# Altium schematic sheet fuenteProgramable.SchDoc
size A4
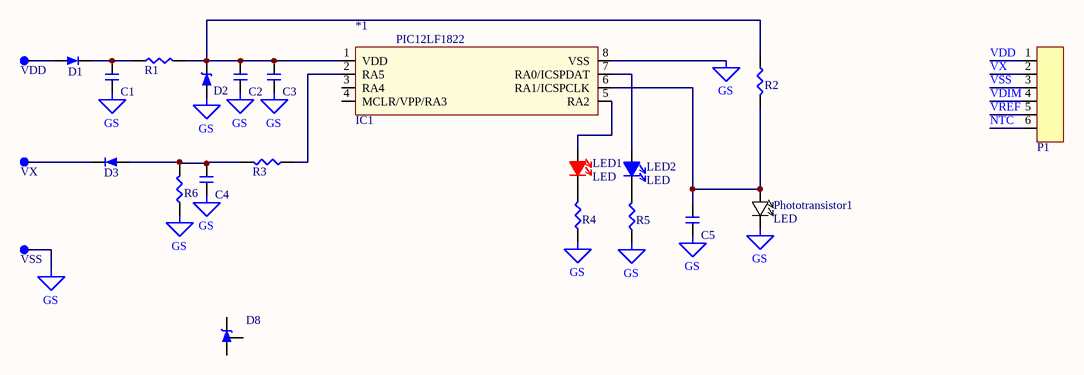
[diagram p0: fuenteProgramable.SchDoc]

## Parts
*1  IC1  [SOIC-8]
C1  Capacitor  [0805]  (value not drawn)
C2  Capacitor  [0805]  (value not drawn)
C3  Capacitor  [0805]  (value not drawn)
C4  Capacitor  [0805]  (value not drawn)
C5  Capacitor  [0805]  (value not drawn)
D1  Diodo  [0805]  (value not drawn)
D2  Zener  [MINIMELF]  (value not drawn)
D3  Diodo  [0805]  (value not drawn)
D8  TL431  [SOT23]  (value not drawn)
LED1  LED  [LED Red 3mm TH V]
LED2  LED  [LED Blue 3mm TH V]
P1  C6pin  [C6PB]  (value not drawn)
Phototransistor1  LED  [LED White 3mm TH V]
R1  Resistencia  [0805]  (value not drawn)
R2  Resistencia  [0805]  (value not drawn)
R3  Resistencia  [0805]  (value not drawn)
R4  Resistencia  [0805]  (value not drawn)
R5  Resistencia  [0805]  (value not drawn)
R6  Resistencia  [0805]  (value not drawn)
VDD  Pad  [Pad3x5]  (value not drawn)  (no BOM)
VSS  Pad  [Pad3x5]  (value not drawn)  (no BOM)
VX  Pad  [Pad3x5]  (value not drawn)  (no BOM)

## Nets
GS: *1.8(VSS) C1.1 C2.2 C3.2 C4.2 C5.2 D2.2 Phototransistor1.1 R4.1 R5.1 R6.1 VSS.0
NTC: P1.6
VDD: P1.1
VDIM: P1.4
VREF: P1.5
VSS: P1.3
VX: P1.2
Net*1_1: *1.1(VDD) C2.1 C3.1 D2.1 R1.2 R2.1
Net*1_2: *1.2(RA5) R3.1
Net*1_5: *1.5(RA2) LED1.2
Net*1_6: *1.6(RA1/ICSPCLK) C5.1 Phototransistor1.2 R2.2
Net*1_7: *1.7(RA0/ICSPDAT) LED2.2
NetC1_2: C1.2 D1.1 R1.1
NetC4_1: C4.1 D3.2 R3.2 R6.2
NetD1_2: D1.2 VDD.0
NetD3_1: D3.1 VX.0
NetLED1_1: LED1.1 R4.2
NetLED2_1: LED2.1 R5.2

Not connected (* = marked no-connect by the designer): *1 3(RA4) 4(MCLR/VPP/RA3); D8 1 2 3

## Notes on the sheet
- (in symbol Component_1) PIC12LF1822

## Library data of the parts
*1 = Component_1
D8 = TL431: pin to pad: 1>3 2>1 3>2
LED1 = LED Red
LED2 = LED Blue
P1 = C6pin: Conector 6 pines
Phototransistor1 = LED White
C1-C5 = Capacitor: Código ELT: *; Tecnología: *
D1 D3 = Diodo: Código ELT: *; Tecnología: *
D2 = Zener: Código ELT: *; Tecnología: *
R1-R6 = Resistencia: Código ELT: *; Tecnología: *